# EAGLE schematic Eagle CAD XO game (EAGLE 7.5.0)
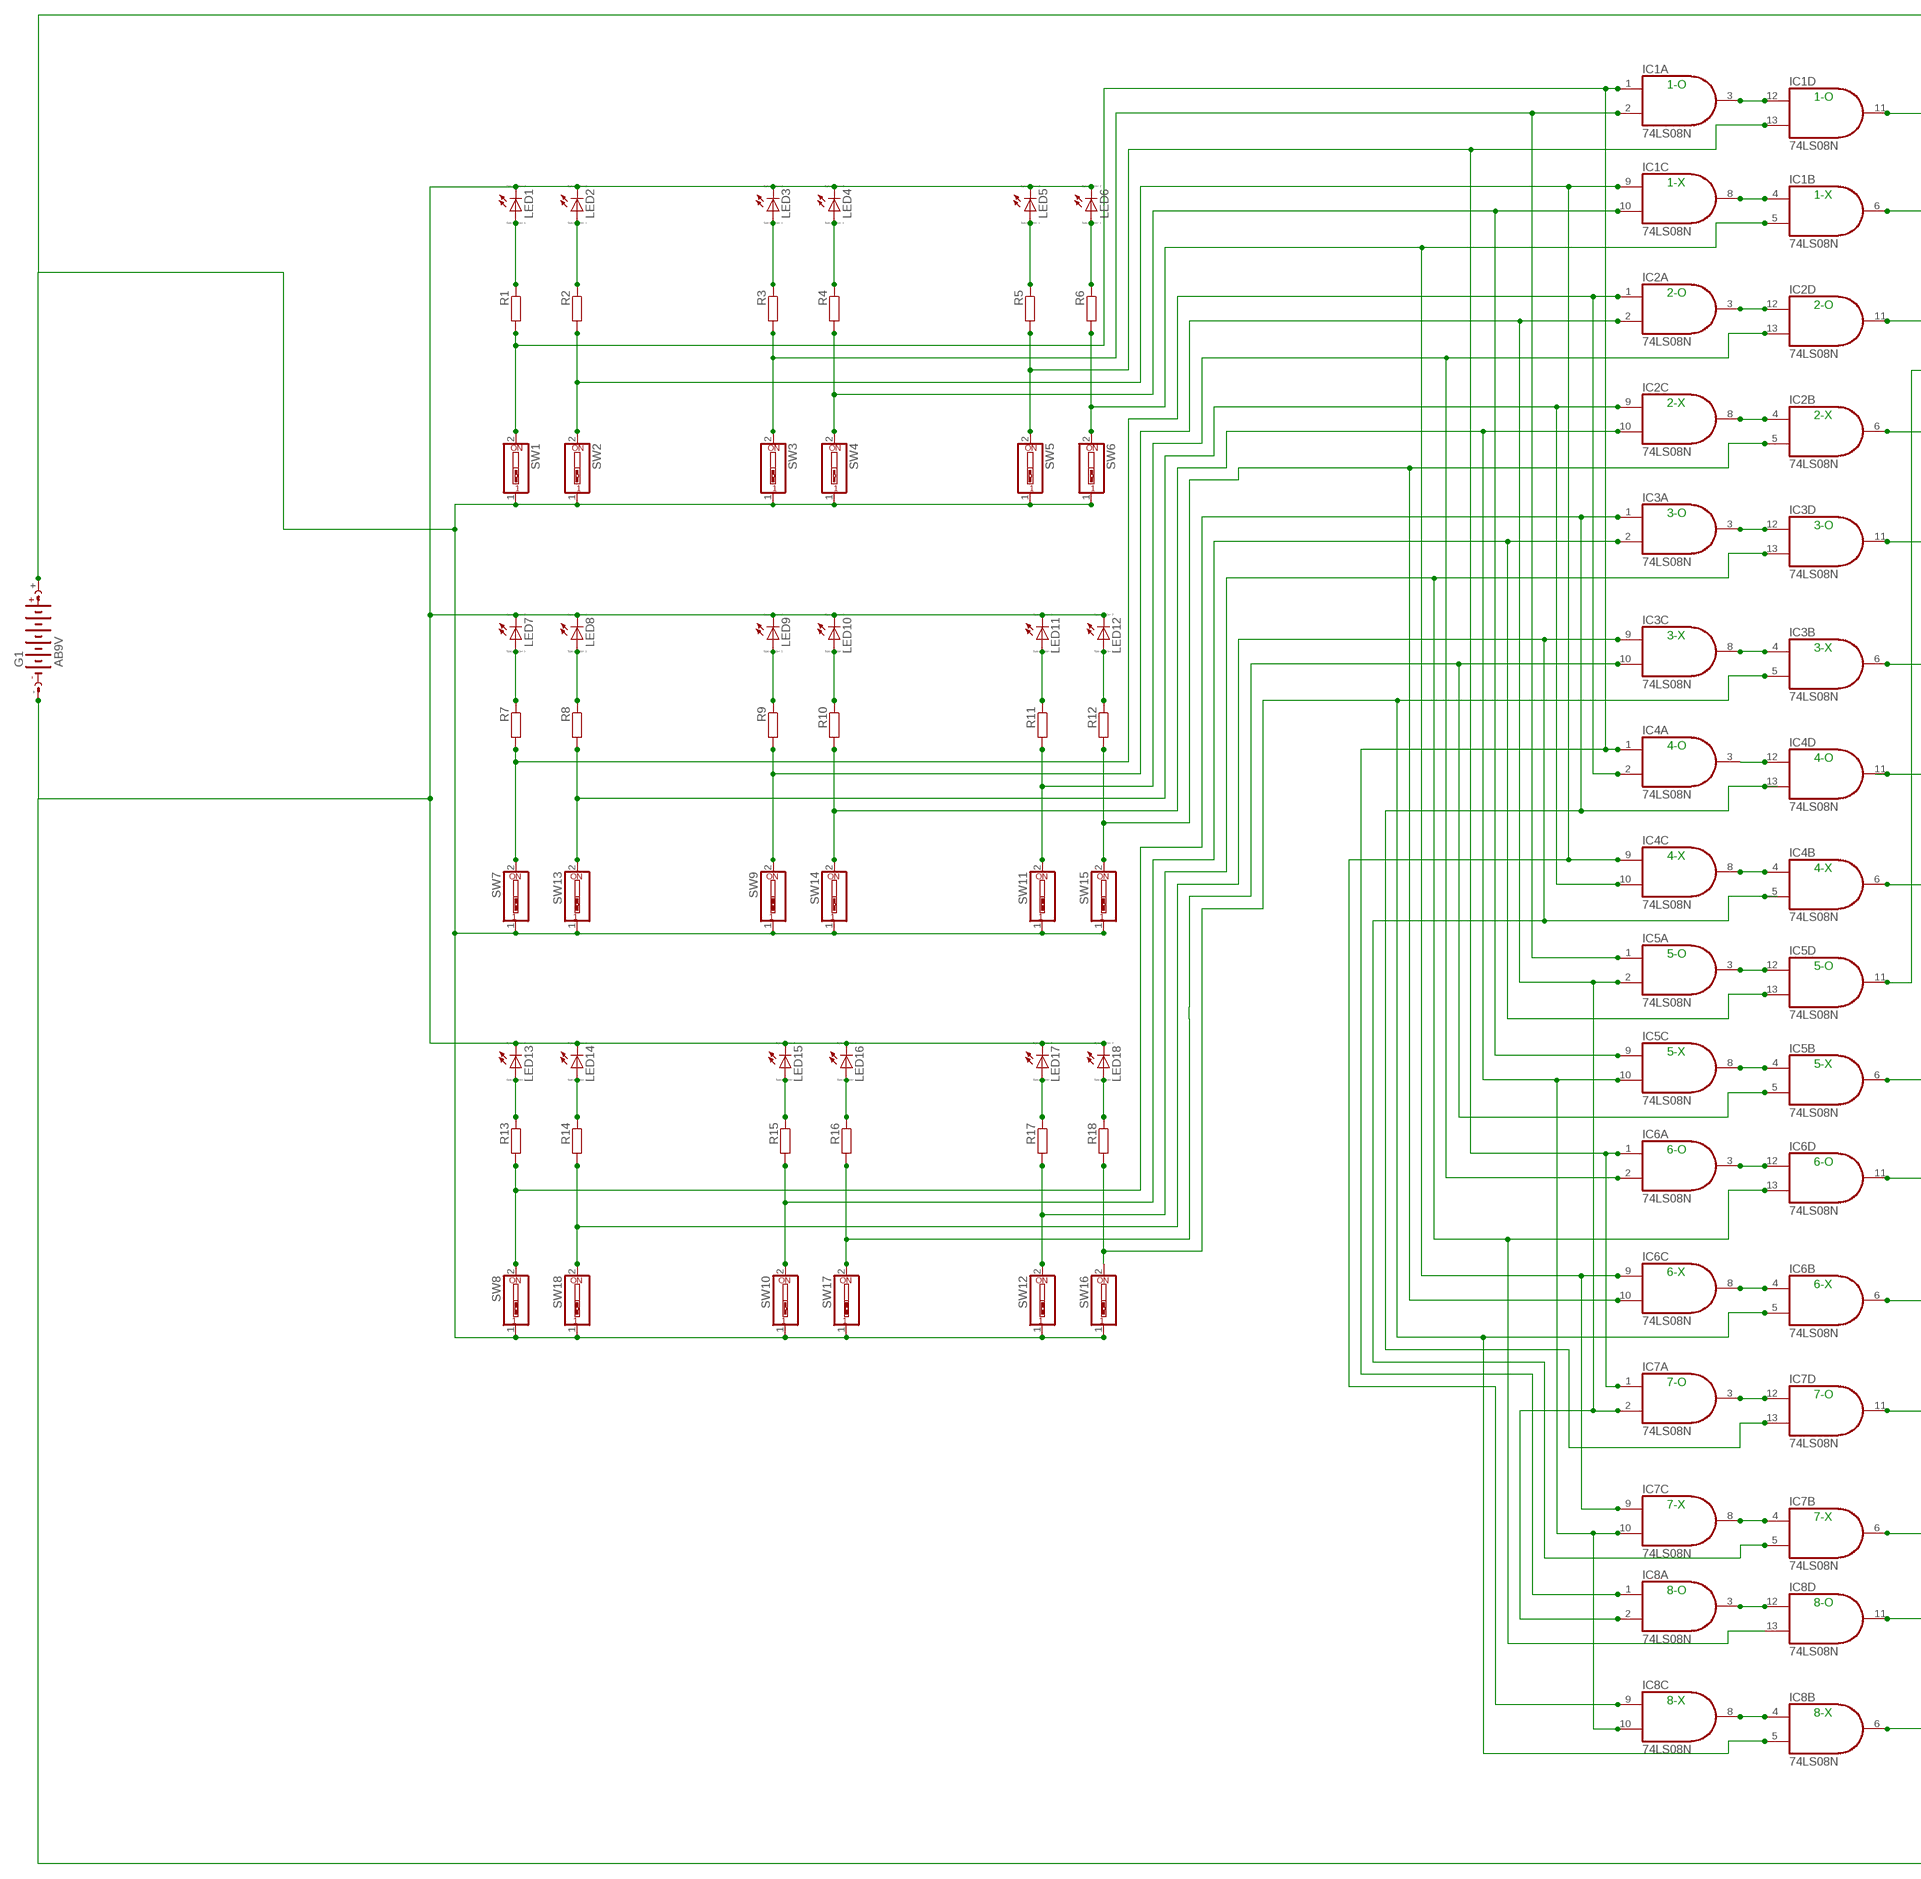
[diagram p0: schematic, sheet 1, part 1 of 2]
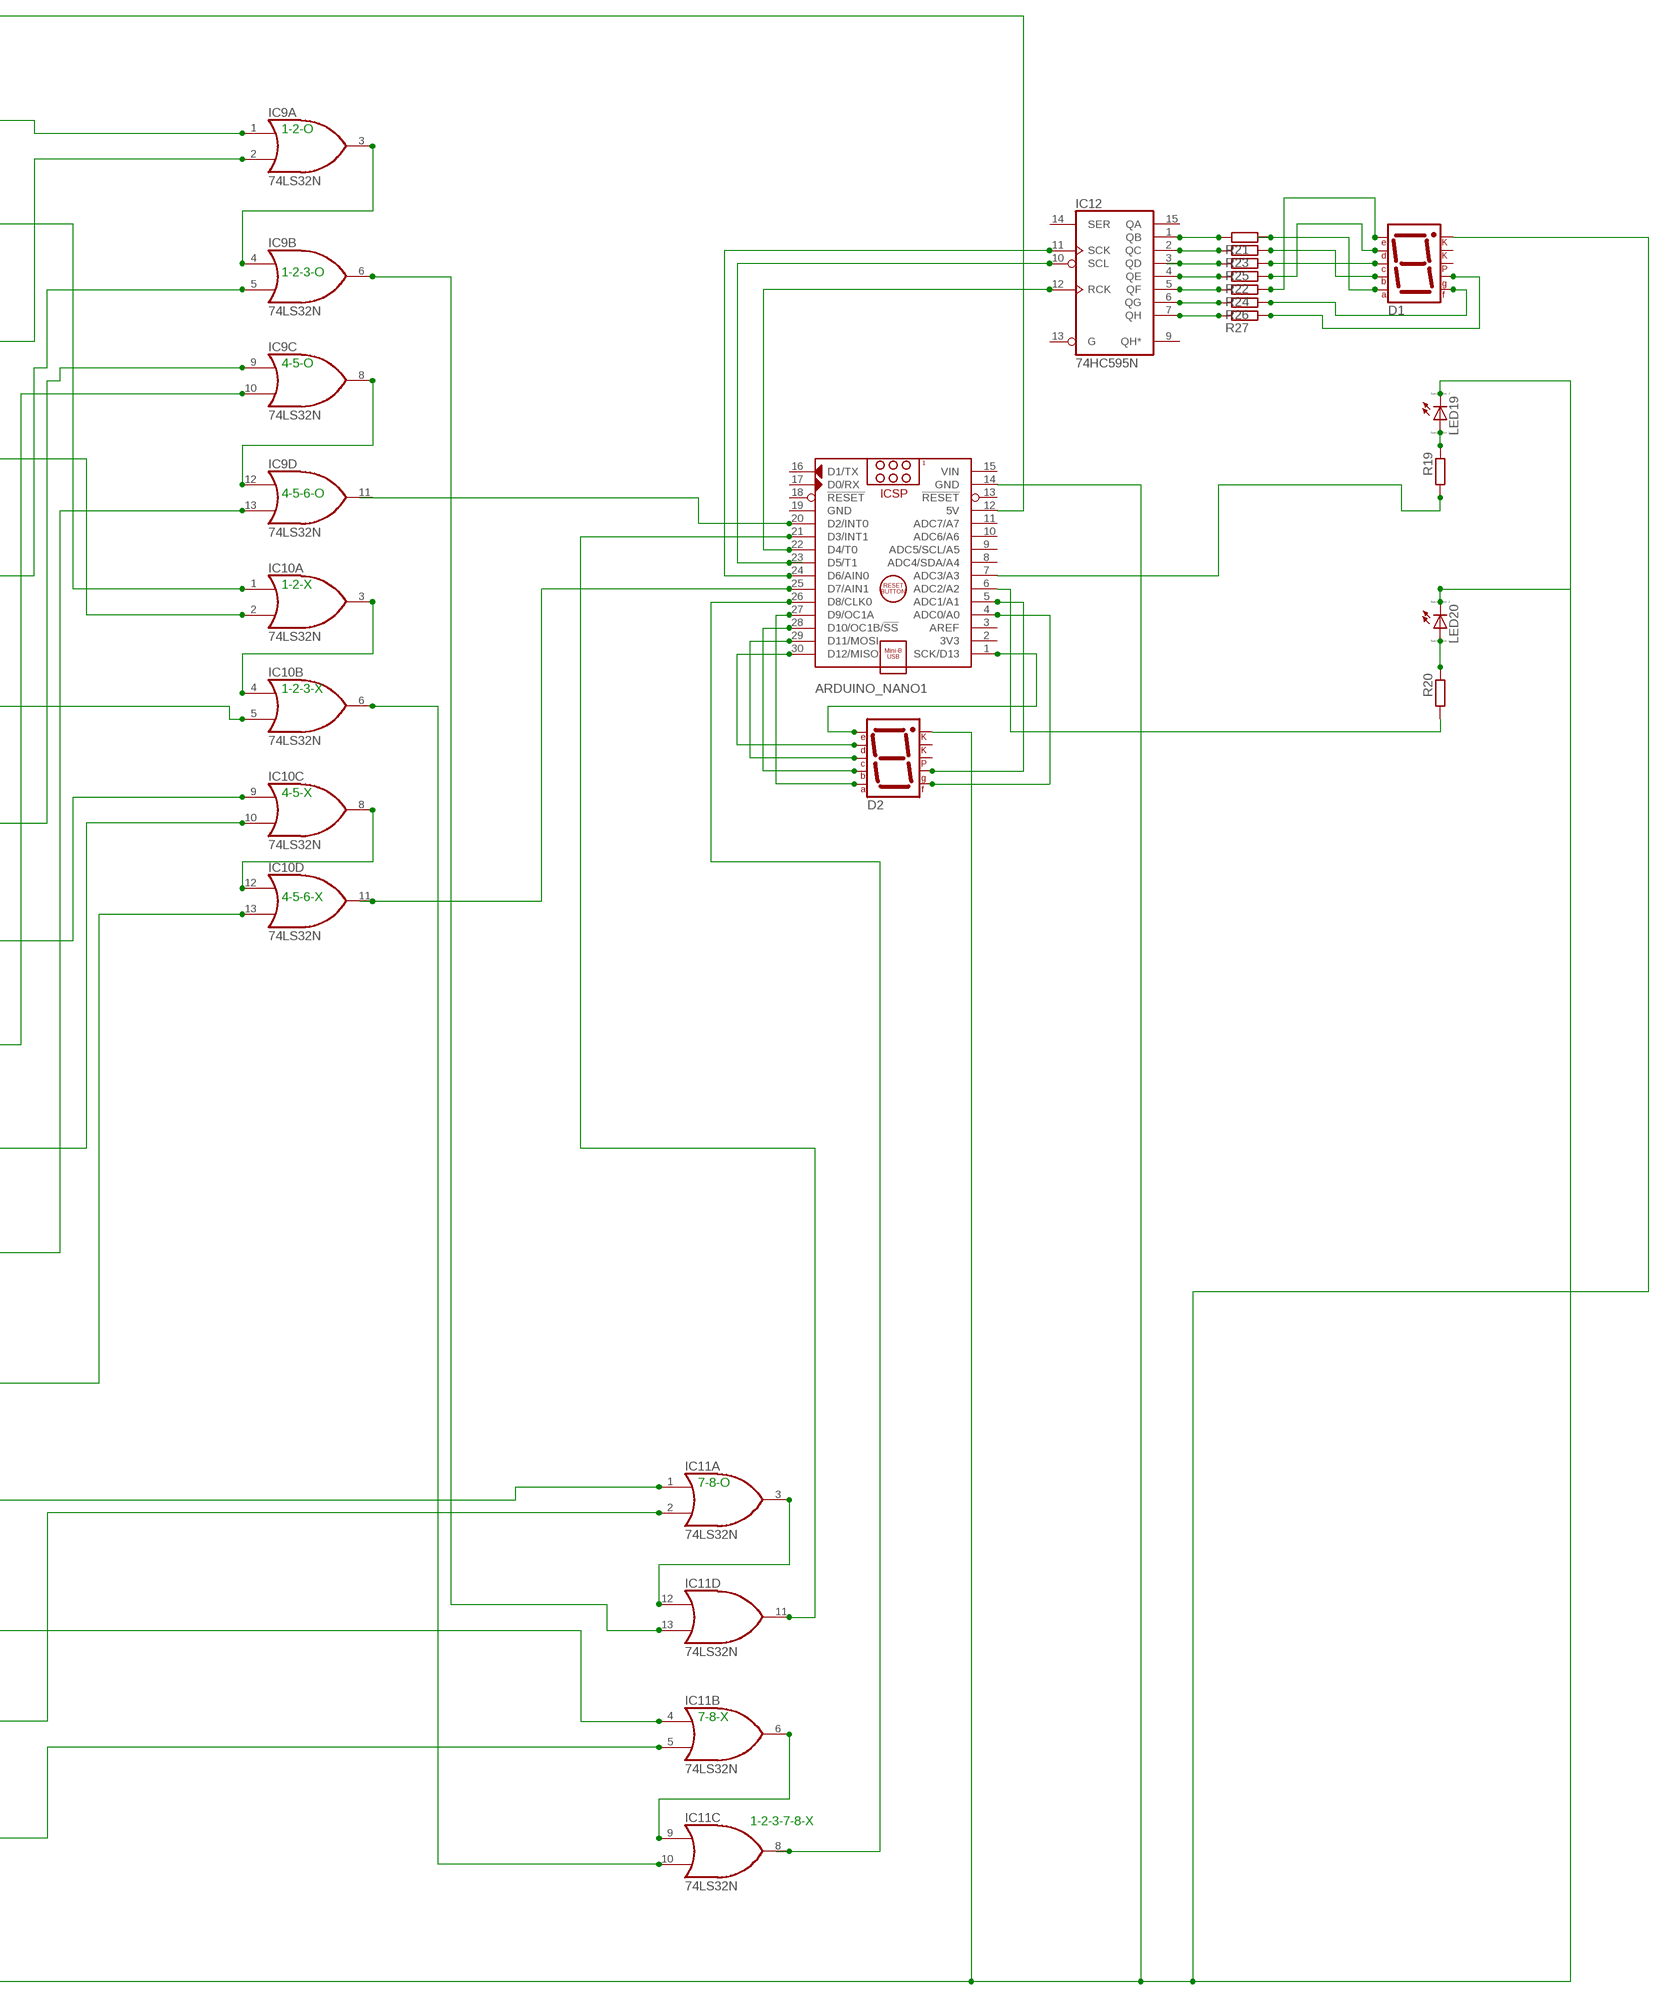
[diagram p1: schematic, sheet 1, part 2 of 2]

## Parts
ARDUINO_NANO1  ARDUINO_NANO  [ARDUINO_NANO]
D1  7SEG-CK  [7SEG-13]
D2  7SEG-CK  [7SEG-13]
G1  AB9V  [AB9V]
IC1  74LS08N  [DIL14]
IC2  74LS08N  [DIL14]
IC3  74LS08N  [DIL14]
IC4  74LS08N  [DIL14]
IC5  74LS08N  [DIL14]
IC6  74LS08N  [DIL14]
IC7  74LS08N  [DIL14]
IC8  74LS08N  [DIL14]
IC9  74LS32N  [DIL14]
IC10  74LS32N  [DIL14]
IC11  74LS32N  [DIL14]
IC12  74HC595N  [DIL16]
LED1  LED_ELD260  [LED_LD260]
LED2  LED_ELD260  [LED_LD260]
LED3  LED_ELD260  [LED_LD260]
LED4  LED_ELD260  [LED_LD260]
LED5  LED_ELD260  [LED_LD260]
LED6  LED_ELD260  [LED_LD260]
LED7  LED_ELD260  [LED_LD260]
LED8  LED_ELD260  [LED_LD260]
LED9  LED_ELD260  [LED_LD260]
LED10  LED_ELD260  [LED_LD260]
LED11  LED_ELD260  [LED_LD260]
LED12  LED_ELD260  [LED_LD260]
LED13  LED_ELD260  [LED_LD260]
LED14  LED_ELD260  [LED_LD260]
LED15  LED_ELD260  [LED_LD260]
LED16  LED_ELD260  [LED_LD260]
LED17  LED_ELD260  [LED_LD260]
LED18  LED_ELD260  [LED_LD260]
LED19  LED_ELD260  [LED_LD260]
LED20  LED_ELD260  [LED_LD260]
R1  R-EU_0204/7  [0204/7]
R2  R-EU_0204/7  [0204/7]
R3  R-EU_0204/7  [0204/7]
R4  R-EU_0204/7  [0204/7]
R5  R-EU_0204/7  [0204/7]
R6  R-EU_0204/7  [0204/7]
R7  R-EU_0204/7  [0204/7]
R8  R-EU_0204/7  [0204/7]
R9  R-EU_0204/7  [0204/7]
R10  R-EU_0204/7  [0204/7]
R11  R-EU_0204/7  [0204/7]
R12  R-EU_0204/7  [0204/7]
R13  R-EU_0204/7  [0204/7]
R14  R-EU_0204/7  [0204/7]
R15  R-EU_0204/7  [0204/7]
R16  R-EU_0204/7  [0204/7]
R17  R-EU_0204/7  [0204/7]
R18  R-EU_0204/7  [0204/7]
R19  R-EU_0204/7  [0204/7]
R20  R-EU_0204/7  [0204/7]
R21  R-EU_0204/7  [0204/7]
R22  R-EU_0204/7  [0204/7]
R23  R-EU_0204/7  [0204/7]
R24  R-EU_0204/7  [0204/7]
R25  R-EU_0204/7  [0204/7]
R26  R-EU_0204/7  [0204/7]
R27  R-EU_0204/7  [0204/7]
SW1  SW_DIP-1  [EDG-01]
SW2  SW_DIP-1  [EDG-01]
SW3  SW_DIP-1  [EDG-01]
SW4  SW_DIP-1  [EDG-01]
SW5  SW_DIP-1  [EDG-01]
SW6  SW_DIP-1  [EDG-01]
SW7  SW_DIP-1  [EDG-01]
SW8  SW_DIP-1  [EDG-01]
SW9  SW_DIP-1  [EDG-01]
SW10  SW_DIP-1  [EDG-01]
SW11  SW_DIP-1  [EDG-01]
SW12  SW_DIP-1  [EDG-01]
SW13  SW_DIP-1  [EDG-01]
SW14  SW_DIP-1  [EDG-01]
SW15  SW_DIP-1  [EDG-01]
SW16  SW_DIP-1  [EDG-01]
SW17  SW_DIP-1  [EDG-01]
SW18  SW_DIP-1  [EDG-01]

## Nets
N$1: LED1.A R1.1
N$2: LED2.A R2.1
N$3: LED3.A R3.1
N$4: LED4.A R4.1
N$5: IC1.1(A:I0) IC4.1(A:I0) IC8.1(A:I0) R1.2 SW1.2
N$6: IC1.9(C:I0) IC4.9(C:I0) IC8.9(C:I0) R2.2 SW2.2
N$7: IC1.2(A:I1) IC5.1(A:I0) R3.2 SW3.2
N$8: IC1.10(C:I1) IC5.9(C:I0) R4.2 SW4.2
N$9: IC1.13(D:I1) IC6.1(A:I0) IC7.1(A:I0) R5.2 SW5.2
N$10: IC1.5(B:I1) IC6.9(C:I0) IC7.9(C:I0) R6.2 SW6.2
N$11: LED5.A R5.1
N$12: LED6.A R6.1
N$13: IC2.1(A:I0) IC4.2(A:I1) R7.2 SW7.2
N$14: IC3.5(B:I1) IC6.5(B:I1) IC8.5(B:I1) R18.2 SW16.2
N$15: LED8.A R8.1
N$16: LED7.A R7.1
N$17: LED9.A R9.1
N$18: LED10.A R10.1
N$19: IC2.2(A:I1) IC5.2(A:I1) IC7.2(A:I1) IC8.2(A:I1) R9.2 SW9.2
N$20: IC2.10(C:I1) IC5.10(C:I1) IC7.10(C:I1) IC8.10(C:I1) R10.2 SW14.2
N$21: IC2.13(D:I1) IC6.2(A:I1) R11.2 SW11.2
N$22: IC2.5(B:I1) IC6.10(C:I1) R12.2 SW15.2
N$23: LED12.A R12.1
N$24: LED11.A R11.1
N$25: IC3.1(A:I0) IC4.13(D:I1) IC7.13(D:I1) R13.2 SW8.2
N$26: IC3.9(C:I0) IC4.5(B:I1) IC7.5(B:I1) R14.2 SW18.2
N$27: LED13.A R13.1
N$28: LED14.A R14.1
N$29: LED15.A R15.1
N$30: LED16.A R16.1
N$31: IC3.10(C:I1) IC5.5(B:I1) R16.2 SW17.2
N$32: IC3.2(A:I1) IC5.13(D:I1) R15.2 SW10.2
N$33: IC3.13(D:I1) IC6.13(D:I1) IC8.13(D:I1) R17.2 SW12.2
N$34: IC2.11(D:O) IC9.2(A:I1)
N$35: LED18.A R18.1
N$36: LED17.A R17.1
N$37: ARDUINO_NANO1.24(D6/AIN0) IC12.11(SCK)
N$38: ARDUINO_NANO1.20(D2/INT0)
N$39: ARDUINO_NANO1.23(D5/T1) IC12.10(SCL)
N$40: ARDUINO_NANO1.22(D4/T0) IC12.12(RCK)
N$41: ARDUINO_NANO1.25(D7/AIN1) IC10.11(D:O)
N$42: ARDUINO_NANO1.7(ADC3/A3) R19.2
N$43: IC9.3(A:O) IC9.4(B:I0)
N$44: IC1.11(D:O) IC9.1(A:I0)
N$45: IC7.11(D:O) IC11.1(A:I0)
N$46: IC1.3(A:O) IC1.12(D:I0)
N$47: IC1.4(B:I0) IC1.8(C:O)
N$48: IC2.3(A:O) IC2.12(D:I0)
N$49: IC2.4(B:I0) IC2.8(C:O)
N$50: IC3.3(A:O) IC3.12(D:I0)
N$51: IC3.4(B:I0) IC3.8(C:O)
N$52: IC4.3(A:O) IC4.12(D:I0)
N$53: IC4.4(B:I0) IC4.8(C:O)
N$54: IC5.3(A:O) IC5.12(D:I0)
N$55: IC5.4(B:I0) IC5.8(C:O)
N$56: IC6.3(A:O) IC6.12(D:I0)
N$57: IC6.4(B:I0) IC6.8(C:O)
N$58: IC7.3(A:O) IC7.12(D:I0)
N$59: IC7.4(B:I0) IC7.8(C:O)
N$60: IC8.3(A:O) IC8.12(D:I0)
N$61: IC8.4(B:I0) IC8.8(C:O)
N$62: IC3.11(D:O) IC9.5(B:I1)
N$63: IC4.11(D:O) IC9.9(C:I0)
N$64: IC5.11(D:O) IC9.10(C:I1)
N$65: IC9.8(C:O) IC9.12(D:I0)
N$66: IC6.11(D:O) IC9.13(D:I1)
N$67: IC1.6(B:O) IC10.1(A:I0)
N$68: IC2.9(C:I0) IC4.10(C:I1) R8.2 SW13.2
N$69: IC2.6(B:O) IC10.2(A:I1)
N$70: IC10.3(A:O) IC10.4(B:I0)
N$71: IC3.6(B:O) IC10.5(B:I1)
N$72: IC4.6(B:O) IC10.9(C:I0)
N$73: IC5.6(B:O) IC10.10(C:I1)
N$74: IC10.8(C:O) IC10.12(D:I0)
N$75: IC6.6(B:O) IC10.13(D:I1)
N$76: IC8.11(D:O) IC11.2(A:I1)
N$77: IC7.6(B:O) IC11.4(B:I0)
N$78: IC8.6(B:O) IC11.5(B:I1)
N$79: IC11.3(A:O) IC11.12(D:I0)
N$80: IC9.6(B:O) IC11.13(D:I1)
N$81: IC10.6(B:O) IC11.10(C:I1)
N$82: IC11.6(B:O) IC11.9(C:I0)
N$83: IC12.1(QB) R21.1
N$84: IC12.2(QC) R23.1
N$85: IC12.3(QD) R25.1
N$86: IC12.4(QE) R22.1
N$87: IC12.5(QF) R24.1
N$88: IC12.6(QG) R26.1
N$89: IC12.7(QH) R27.1
N$90: D1.7(A) R21.2
N$91: D1.6(B) R23.2
N$92: D1.4(C) R25.2
N$93: D1.2(D) R22.2
N$94: D1.1(E) R24.2
N$95: D1.9(F) R26.2
N$96: D1.10(G) R27.2
N$97: LED19.A R19.1
N$98: ARDUINO_NANO1.27(D9/OC1A) D2.7(A)
N$99: ARDUINO_NANO1.12(5V) G1.+ SW1.1 SW2.1 SW3.1 SW4.1 SW5.1 SW6.1 SW7.1 SW8.1 SW9.1 SW10.1 SW11.1 SW12.1 SW13.1 SW14.1 SW15.1 SW16.1 SW17.1 SW18.1
N$100: LED20.A R20.1
N$101: ARDUINO_NANO1.28(D10/OC1B/!SS) D2.6(B)
N$102: ARDUINO_NANO1.26(D8/CLK0) IC11.8(C:O)
N$103: ARDUINO_NANO1.29(D11/MOSI) D2.4(C)
N$104: ARDUINO_NANO1.30(D12/MISO) D2.2(D)
N$105: ARDUINO_NANO1.14(GND) D1.8(CK2) D2.8(CK2) G1.- LED1.K(C) LED2.K(C) LED3.K(C) LED4.K(C) LED5.K(C) LED6.K(C) LED7.K(C) LED8.K(C) LED9.K(C) LED10.K(C) LED11.K(C) LED12.K(C) LED13.K(C) LED14.K(C) LED15.K(C) LED16.K(C) LED17.K(C) LED18.K(C) LED19.K(C) LED20.K(C)
N$106: ARDUINO_NANO1.1(SCK/D13) D2.1(E)
N$107: ARDUINO_NANO1.4(ADC0/A0) D2.9(F)
N$108: ARDUINO_NANO1.21(D3/INT1) IC11.11(D:O)
N$109: ARDUINO_NANO1.5(ADC1/A1) D2.10(G)
N$111: ARDUINO_NANO1.6(ADC2/A2) R20.2
Unconnected: ARDUINO_NANO1.2(3V3) ARDUINO_NANO1.3(AREF) ARDUINO_NANO1.8(ADC4/SDA/A4) ARDUINO_NANO1.9(ADC5/SCL/A5) ARDUINO_NANO1.10(ADC6/A6) ARDUINO_NANO1.11(ADC7/A7) ARDUINO_NANO1.13(!RESET) ARDUINO_NANO1.16(D1/TX) ARDUINO_NANO1.17(D0/RX) ARDUINO_NANO1.18(!RESET) D1.3(CK1) D1.5(DP) D2.3(CK1) D2.5(DP) IC9.11(D:O) IC12.9(QH*) IC12.13(G) IC12.14(SER) IC12.15(QA)

## Notes on the sheet
- 1-O
- 1-O
- 1-2-O
- 1-X
- 1-X
- 1-2-3-O
- 2-O
- 2-O
- 4-5-O
- 2-X
- 2-X
- 4-5-6-O
- 3-O
- 3-O
- 1-2-X
- 3-X
- 3-X | 1-2-3-X
- 4-O | 4-5-X
- 4-O
- 4-5-6-X
- 4-X
- 4-X
- 5-O
- 5-O
- 5-X
- 5-X
- 6-O
- 6-O
- 6-X
- 6-X
- 7-O
- 7-O | 7-8-O
- 7-X
- 7-X
- 8-O
- 8-O
- 7-8-X
- 8-X
- 8-X | 1-2-3-7-8-X

## Power pins joined to a net without a drawn wire
GND: ARDUINO_NANO1.19(GND) IC1.7(P:GND) IC2.7(P:GND) IC3.7(P:GND) IC4.7(P:GND) IC5.7(P:GND) IC6.7(P:GND) IC7.7(P:GND) IC8.7(P:GND) IC9.7(P:GND) IC10.7(P:GND) IC11.7(P:GND) IC12.8(GND)
VCC: IC1.14(P:VCC) IC2.14(P:VCC) IC3.14(P:VCC) IC4.14(P:VCC) IC5.14(P:VCC) IC6.14(P:VCC) IC7.14(P:VCC) IC8.14(P:VCC) IC9.14(P:VCC) IC10.14(P:VCC) IC11.14(P:VCC) IC12.16(VCC)
VIN: ARDUINO_NANO1.15(VIN)

## Library data of the parts
ARDUINO_NANO1 = ArduinoNanoV30:ARDUINO_NANO: Arduino Nano V3.0 Module Overview: The Arduino Nano is a small, complete, and breadboard-friendly board based on the ATmega328 (Arduino Nano 3.x) or ATmega168 (Arduino Nano 2.x). It has more or less the same functionality of the Arduino Duemilanove, but in a different package. It lacks only a DC power jack, and works with a Mini-B USB cable instead of a standard one. The Nano was designed and is being produced by Gravitech <http://www.gravitech.us/arna30wiatp.html>. General specifications: Item Value Microcontroller Atmel ATmega168 or ATmega328 Operating Voltage (logic level) 5 V Input Voltage (recommended) 7-12 V Input Voltage (limits) 6-20 V Digital I/O Pins 14 (of which 6 provide PWM output) Analog Input Pins 8 DC Current per I/O Pin 40 mA Flash Memory 16 KB (ATmega168) or 32 KB (ATmega328) of which 2 KB used by bootloader SRAM 1 KB (ATmega168) or 2 KB (ATmega328) EEPROM 512 bytes (ATmega168) or 1 KB (ATmega328) Clock Speed 16 MHz Dimensions (Inches) 0.73" x 1.70" Dimensions (mm) 18mm x 45mm Overall height About 9 mm (not including pins) Weigth 5 g Power: The Arduino Nano can be powered via the Mini-B USB connection, 6-20V unregulated external power supply (pin 30), or 5V regulated external power supply (pin 27). The power source is automatically selected to the highest voltage source. Memory: The ATmega168 has 16 KB of flash memory for storing code (of which 2 KB is used for the bootloader); the ATmega328 has 32 KB, (also with 2 KB used for the bootloader). The ATmega168 has 1 KB of SRAM and 512 bytes of EEPROM (which can be read and written with the EEPROM library); the ATmega328 has 2 KB of SRAM and 1 KB of EEPROM. Input and Output: Each of the 14 digital pins on the Nano can be used as an input or output, using pinMode(), digitalWrite(), and digitalRead() functions. They operate at 5 volts. Each pin can provide or receive a maximum of 40 mA and has an internal pull-up resistor (disconnected by default) of 20-50 kOhms. In addition, some pins have specialized functions. Visit Arduino - ArduinoBoardNano <https://www.arduino.cc/en/Main/ArduinoBoardNano>
D1 D2 = special:7SEG-CK: 7-segment DISPLAY single cathode, 13 mm
G1 = battery:AB9V: 9-V BATTERY CLIP
IC1-IC8 = 74xx-us:74*08: Quad 2-input AND gate
IC9-IC11 = 74xx-us:74*32: Quad 2-input OR gate
IC12 = 74xx-eu:74*595: 8-bit SHIFT REGISTER, output latch
LED1-LED20 = eagle-ltspice:LED_E: LED Source: http://www.osram.convergy.de Source: www.luxeon.com Source: www.kingbright.com; SPICEMODEL: NONE; SPICEPREFIX: D; SPICETYPE: diode
R1-R27 = resistor:R-EU_: RESISTOR, European symbol
SW1-SW18 = special:SW_DIP-1: DIP SWITCH